# EAGLE schematic sch (EAGLE 7.1.0)
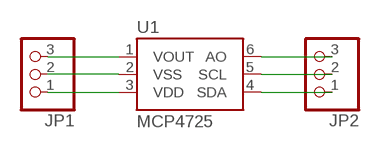
[diagram p0: schematic, sheet 1]

## Parts
JP1  PINHD-1X3  [1X03]
JP2  PINHD-1X3  [1X03]
U1  MCP4725  MCP4725SOT-23  [SOT23-6]

## Nets
N$1: JP1.1 U1.3(VDD)
N$2: JP1.2 U1.2(VSS)
N$3: JP1.3 U1.1(VOUT)
N$4: JP2.3 U1.6(AO)
N$5: JP2.2 U1.5(SCL)
N$6: JP2.1 U1.4(SDA)

## Library data of the parts
JP1 JP2 = pinhead:PINHD-1X3: PIN HEADER
U1 = Sparkfun-Eagle-Libraries:MCP4725: Microchip 12-bit I2C DAC, SOT23-6; PROD_ID: IC-08886